# Altium project FuenteAlimentacion.PrjPcb
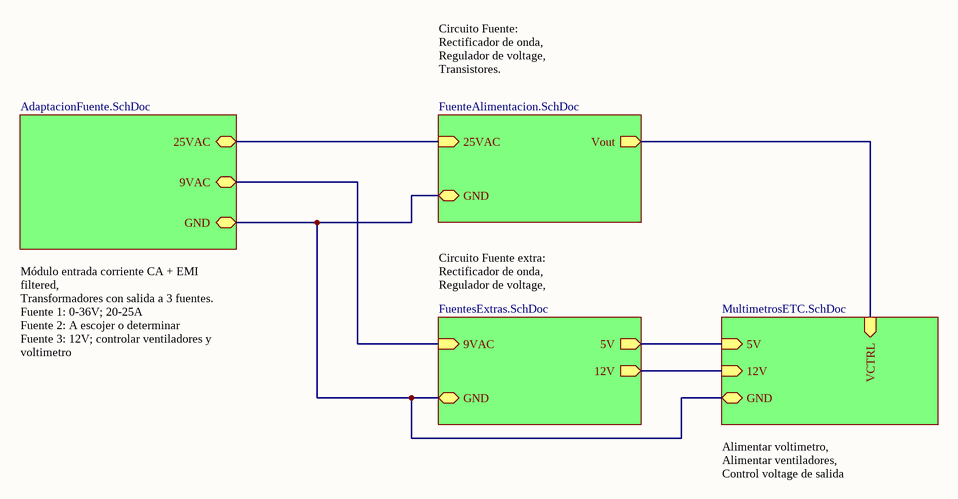
[diagram p0: FuenteAlimentacionTop.SchDoc]
5 sheets, 31 parts. Net scope: hierarchical (ports join the sheet entries above them; power ports are global).
Sheets:
  FuenteAlimentacionTop.SchDoc
     = FuenteAlimentacion.SchDoc
     = AdaptacionFuente.SchDoc
     = FuentesExtras.SchDoc
     = MultimetrosETC.SchDoc

## Sheet FuenteAlimentacionTop.SchDoc
size A4

### Sub-sheets
? = FuenteAlimentacion.SchDoc: 25VAC (in), GND, Vout (out)
? = AdaptacionFuente.SchDoc: 25VAC, GND, 9VAC
? = FuentesExtras.SchDoc: 9VAC (in), GND, 5V (out), 12V (out)
? = MultimetrosETC.SchDoc: 5V (in), GND, 12V (in), VCTRL (in)

### Nets
GND: sheet /GND, sheet /GND, sheet /GND, sheet /GND
NetC?#6_2: sheet /12V, sheet /12V
NetCONN?#6_2: sheet /Vout, sheet /VCTRL
NetCONN?#7_2: sheet /5V, sheet /5V
NetD?#7_2: sheet /9VAC, sheet /9VAC
(unnamed): sheet /25VAC, sheet /25VAC

### Notes on the sheet
- Circuito Fuente:
  Rectificador de onda,
  Regulador de voltage,
  Transistores.
- Circuito Fuente extra:
  Rectificador de onda,
  Regulador de voltage,
- Módulo entrada corriente CA + EMI filtered,
  Transformadores con salida a 3 fuentes.
  Fuente 1: 0-36V; 20-25A
  Fuente 2: A escojer o determinar
  Fuente 3: 12V; controlar ventiladores y  voltimetro
- Alimentar voltimetro,
  Alimentar ventiladores,
  Control voltage de salida

## Sheet FuenteAlimentacion.SchDoc
size A4
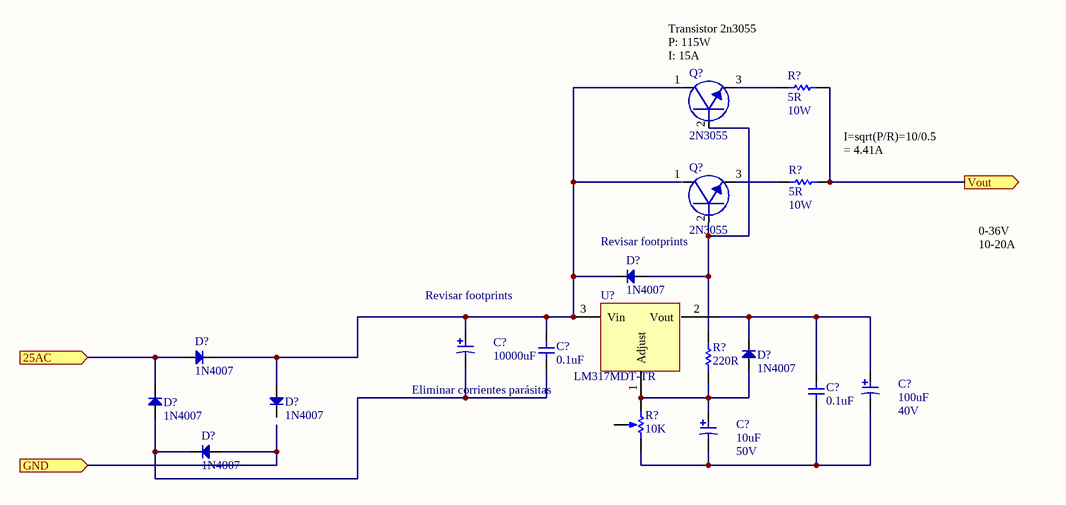
[diagram p1: FuenteAlimentacion.SchDoc]

### Parts
(Parts that share a designator on the sheet are numbered #1, #2 ... from top to bottom, then left to right.)
C?#1  value 10000uF  [C Elec TH V 18x35-7.5]  (hidden comment: C-Pol-10000uF-)
C?#2  value 0.1uF  [C0805-0.80]  (hidden comment: C-Cer-0.1uF-0603-50V)
C?#3  value 100uF  VDC: 40V  [RAD-0.3]  (hidden comment: C-Ele-100uF-08-40V)
C?#4  value 0.1uF  [C0805-0.80]  (hidden comment: C-Cer-0.1uF-0603-50V)
C?#5  value 10uF  Voltage: 50V  [C Elec TH V 18x35-7.5]  (hidden comment: C-Ele-10uF-05-50V)
D?#1  1N4007  [DO-35 Glass]
D?#2  1N4007  [DO-35 Glass]
D?#3  1N4007  [DO-35 Glass]
D?#4  1N4007  [DO-35 Glass]
D?#5  1N4007  [DO-35 Glass]
D?#6  1N4007  [DO-35 Glass]
Q?#1  2N3055  [TO92-2.54]
Q?#2  2N3055  [TO92-2.54]
R?#1  value 5R  Power: 10W  [R Axial 0.4]  (hidden comment: R-5-08-5)
R?#2  value 5R  Power: 10W  [R Axial 0.4]  (hidden comment: R-5-08-5)
R?#3  value 220R  [R0603-0.45]  (hidden comment: R-220-0603-5)
R?#4  value 10K  [VR5]  (hidden comment: RPot-10K-06-KNP)
U?  LM317MDT-TR  [TO220-3]

### Ports
25AC (in), GND (in), Vout (out)

### Nets
GND: D?#6.2 ; port GND
NetC?#1_2: C?#1.2 C?#2.2 D?#1.1 D?#2.1 D?#4.2 Q?#1.1 U?.3(Vin)
NetC?#3_1: C?#3.1 C?#4.1 C?#5.1 R?#4.2(BOT)
NetC?#3_2: C?#3.2 C?#4.2 D?#3.1 U?.2(Vout)
NetC?#5_2: C?#5.2 D?#3.2 R?#3.1 R?#4.1(TOP) U?.1(Adjust)
NetCONN?#6_2: R?#1.2 R?#2.2 ; port Vout
NetD?#1_2: D?#1.2 Q?#1.2 R?#3.2
NetD?#2_2: D?#2.2 D?#5.1 ; port 25AC
NetD?#5_2: D?#5.2 D?#6.1
NetQ?#1_3: Q?#1.3 R?#1.1
NetQ?#2_3: Q?#2.3 R?#2.1

Not connected (* = marked no-connect by the designer): C?#1 1; C?#2 1; D?#4 1; Q?#2 1 2; R?#4 3(TAP)

### Notes on the sheet
- Transistor 2n3055
  P: 115W
  I: 15A
- (near R?#2) I=sqrt(P/R)=10/0.5
  = 4.41A
- Revisar footprints
- 0-36V
  10-20A
- (near C?#1) Revisar footprints
- Eliminar corrientes parásitas

### Library data of the parts
C?#1 = C-Pol-10000uF-: Capacitor, polarized, generic; Manofacturer: Mouser; Manofacturer Supply Numb: B41252A6109M000
C?#2 C?#4 = C-Cer-0.1uF-0603-50V: Capacitor, generic; Manofacturer: Wurth Electronics; Manofacture Code: 885012206095; Supplier: Mouser; Supplier Number Code: 710-885012206095; Price: 0.05
C?#3 = C-Ele-100uF-08-40V: Capacitor; Manofacturer: Vishay / BC Components; Manofacturer Code: MAL203137101E3; Supplier: Mouser; Supplier Number Code: 594-2222-031-37101; Category: Capacitance-Electrolitic; Pricing: 0.638
C?#5 = C-Ele-10uF-05-50V: Capacitor, polarized, generic; Manofacturer: Lelon; Manofacturer Supply Numb: REA100M1HBK-0511P; Supplier: Mouser; Supplier Number Code: 140-REA100M1HBK0511P; Category: Capacitance-Electrolitic; Pricing: 0.086
D?#1 D?#3 = D-1N4007-G: Diodes - General Purpose, Power, Switching Hi Conductance Fast; Manofacturer: Comchip Technology; Manufacturer Code: 1N4007-G; Category: Diodes - General Purpose, Power, Switching; Pricing: 0.094; Supplier: Mouser; Supplier Number Code: 750-1N4007-G; Value: *
D?#2 D?#4-D?#6 = D-UF4004-TP-DO-41: Diodes - General Purpose, Power, Switching Hi Conductance Fast; Manofacturer: Micro Commercial Components (MCC); Manufacturer Code: UF4004-TP; Category: Diodes - General Purpose, Power, Switching; Pricing: 0.094; Supplier: Mouser; Supplier Number Code: 833-UF4004-TP; Value: *
Q?#1 Q?#2 = 2N3055: BJT NPN Transistor-2N3055G; Manofacturer: ON Semiconductor; Value: *; Supplier: Mouser; Supplier Number Code: 863-2N3055G; Manofacturer Code: 2N3055G; Pricing: 1.90; Category: Transistor-BJT-NPN
R?#1 R?#2 = R-5-08-5: Resistor, generic; Manofacturer: Xilon; Manofacturer Code: 280-CR10-5.0-RC; Category: Resistance; Supplier: Mouser; Supplier Number Code: 280-CR10-5.0-RC; Pricing: 0.799
R?#3 = R-220-0603-5: Resistor, generic; Manofacturer: Yageo; Manofacturer Code: RC0603JR-07220RL; Category: Resistance; Supplier: Mouser; Supplier Number Code: 603-RC0603JR-07220RL; Pricing: 0.085
R?#4 = RPot-10K-06-KNP: Potentiometer; Value: 10K; Manofacture: Welwyn Components / TT Electronics; Manofacture Code: P160KNPD-4FC20B10K; Supplier: Mouser; Category: Potentiometer; Supplier Number Code: 858-P160KNP4FC20B10K
U? = LM317MDT-TR: IC POS ADJ VOLTAGE REGUL. 1.2-37V; Manufacturer: STMicroelectronics; Category: Integrated Circuits (ICs); Supplier: Mouser; Supplier Number Code: 511-LM317MDT-TR; Pricing: 0.408; Manufacturer Part Number: LM317MDT-TR

## Sheet AdaptacionFuente.SchDoc
size A4
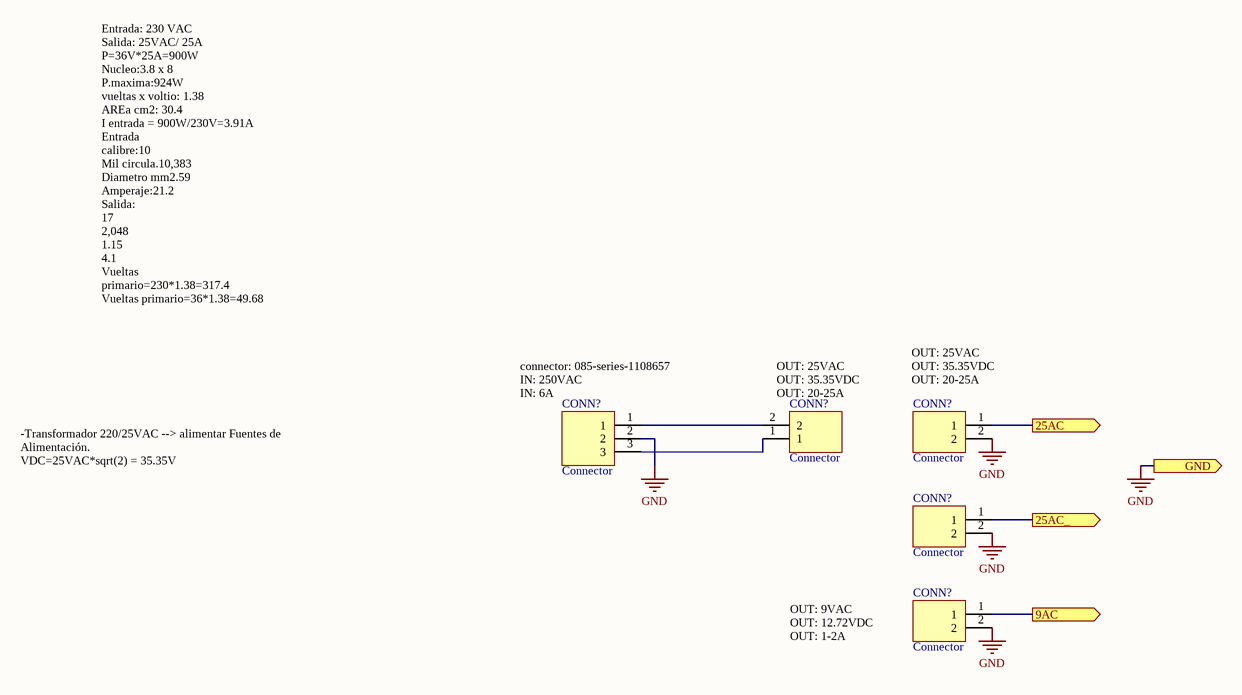
[diagram p2: AdaptacionFuente.SchDoc]

### Parts
(Parts that share a designator on the sheet are numbered #1, #2 ... from top to bottom, then left to right.)
CONN?#1  Connector  [1x2x2.54 Pin Header TH V]
CONN?#2  Connector  [1x2x2.54 Pin Header TH V]
CONN?#3  Connector  [1x3x2.54 Pin Header TH V]
CONN?#4  Connector  [1x2x2.54 Pin Header TH V]
CONN?#5  Connector  [1x2x2.54 Pin Header TH V]

### Ports
9AC (out), 25AC (out), 25AC_ (out), GND (out)

### Nets
GND: CONN?#2.2 CONN?#3.2 CONN?#4.2 CONN?#5.2 ; port GND
NetCONN?#1_1: CONN?#1.1 CONN?#3.3
NetCONN?#1_2: CONN?#1.2 CONN?#3.1
NetCONN?#2_1: CONN?#2.1 ; port 25AC
NetCONN?#4_1: CONN?#4.1 ; port 25AC_
NetCONN?#5_1: CONN?#5.1 ; port 9AC

### Notes on the sheet
- Entrada: 230 VAC
  Salida: 25VAC/ 25A
  P=36V*25A=900W
  Nucleo:3.8 x 8
  P.maxima:924W
  vueltas x voltio: 1.38
  AREa cm2: 30.4
  I entrada = 900W/230V=3.91A
  Entrada
  calibre:10
  Mil circula.10,383
  Diametro mm2.59
  Amperaje:21.2
  Salida:
  17
  2,048
  1.15
  4.1
  Vueltas primario=230*1.38=317.4
  Vueltas primario=36*1.38=49.68
- (near CONN?#3) connector: 085-series-1108657
  IN: 250VAC
  IN: 6A
- (near CONN?#1) OUT: 25VAC
  OUT: 35.35VDC
  OUT: 20-25A
- (near CONN?#2) OUT: 25VAC
  OUT: 35.35VDC
  OUT: 20-25A
- -Transformador 220/25VAC --> alimentar Fuentes de Alimentación.
  VDC=25VAC*sqrt(2) = 35.35V
- OUT: 9VAC
  OUT: 12.72VDC
  OUT: 1-2A

### Library data of the parts
CONN?#1 CONN?#2 CONN?#4 CONN?#5 = Header 1x2
CONN?#3 = Header 1x3

## Sheet FuentesExtras.SchDoc
size A4
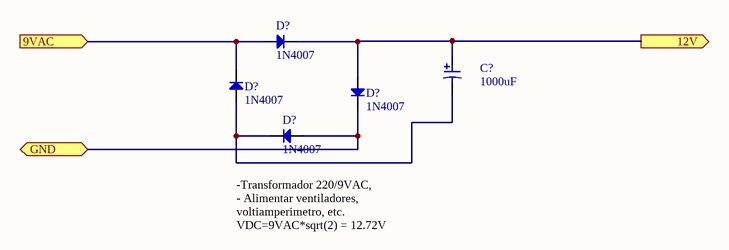
[diagram p3: FuentesExtras.SchDoc]

### Parts
(Parts that share a designator on the sheet are numbered #1, #2 ... from top to bottom, then left to right.)
C?#6  value 1000uF  [C Elec SMD 6.3x5.4]  (hidden comment: C-Pol-1000uF-4x6.3)
D?#7  1N4007  [DO-35 Glass]
D?#8  1N4007  [DO-35 Glass]
D?#9  1N4007  [DO-35 Glass]
D?#10  1N4007  [DO-35 Glass]

### Ports
9VAC (in), 12V (out), GND (bidir)

### Nets
GND: D?#9.1 D?#10.2 ; port GND
NetC?#6_1: C?#6.1 D?#8.2 D?#10.1
NetC?#6_2: C?#6.2 D?#7.1 D?#9.2 ; port 12V
NetD?#7_2: D?#7.2 D?#8.1 ; port 9VAC

### Notes on the sheet
- (near D?#10) -Transformador 220/9VAC,
  - Alimentar ventiladores, voltiamperimetro, etc.
  VDC=9VAC*sqrt(2) = 12.72V

### Library data of the parts
C?#6 = C-Pol-1000uF-4x6.3: Capacitor, polarized, generic; Manofacturer: Mouser; Manofacturer Supply Numb: UCM1C102MNL1GS
D?#7-D?#10 = D-UF4004-TP-DO-41: as D?#2 on sheet FuenteAlimentacion; Manufacturer Code: UF4004-TP; Category: Diodes - General Purpose, Power, Switching; Pricing: 0.094; Supplier: Mouser; Supplier Number Code: 833-UF4004-TP; Value: *

## Sheet MultimetrosETC.SchDoc
size A4
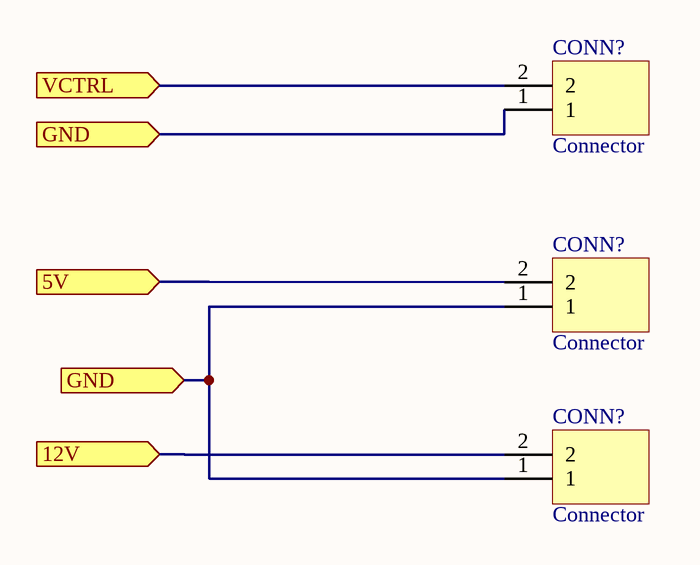
[diagram p4: MultimetrosETC.SchDoc]

### Parts
(Parts that share a designator on the sheet are numbered #1, #2 ... from top to bottom, then left to right.)
CONN?#6  Connector  [1x2x2.54 Pin Header TH V]
CONN?#7  Connector  [1x2x2.54 Pin Header TH V]
CONN?#8  Connector  [1x2x2.54 Pin Header TH V]

### Ports
5V (in), 12V (in), GND (in), VCTRL (in)

### Nets
GND: CONN?#6.1 CONN?#7.1 CONN?#8.1 ; port GND
NetC?#6_2: CONN?#8.2 ; port 12V
NetCONN?#6_2: CONN?#6.2 ; port VCTRL
NetCONN?#7_2: CONN?#7.2 ; port 5V

### Library data of the parts
CONN?#6-CONN?#8 = Header 1x2

## Nets that join several sheets
GND: FuenteAlimentacion (D?#6.2), AdaptacionFuente (CONN?#2.2 CONN?#3.2 CONN?#4.2 CONN?#5.2), FuentesExtras (D?#9.1 D?#10.2), MultimetrosETC (CONN?#6.1 CONN?#7.1 CONN?#8.1)
NetC?#6_2: FuentesExtras (C?#6.2 D?#7.1 D?#9.2), MultimetrosETC (CONN?#8.2)
NetCONN?#6_2: FuenteAlimentacion (R?#1.2 R?#2.2), MultimetrosETC (CONN?#6.2)